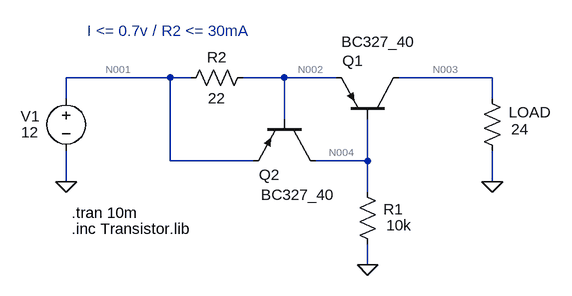
[diagram p0: schematic v1.1.asc]
v1.1.asc, the LTspice schematic file:
Version 4.1
SHEET 1 880 680
WIRE 64 128 -96 128
WIRE 96 128 64 128
WIRE 240 128 176 128
WIRE 320 128 240 128
WIRE 560 128 416 128
WIRE -96 160 -96 128
WIRE 560 160 560 128
WIRE 240 192 240 128
WIRE 64 256 64 128
WIRE 192 256 64 256
WIRE 368 256 368 192
WIRE 368 256 288 256
WIRE -96 288 -96 240
WIRE 560 288 560 240
WIRE 368 304 368 256
WIRE 368 416 368 384
FLAG -96 288 0
FLAG 560 288 0
FLAG 368 416 0
SYMBOL voltage -96 144 R0
WINDOW 0 -70 43 Left 2
WINDOW 3 -69 68 Left 2
WINDOW 123 0 0 Left 0
WINDOW 39 0 0 Left 0
SYMATTR InstName V1
SYMATTR Value 12
SYMBOL res 384 400 R180
WINDOW 0 -39 70 Left 2
WINDOW 3 -52 45 Left 2
SYMATTR InstName R1
SYMATTR Value 10k
SYMBOL res 192 112 R90
WINDOW 0 0 56 VBottom 2
WINDOW 3 32 56 VTop 2
SYMATTR InstName R2
SYMATTR Value 22
SYMBOL res 576 256 R180
WINDOW 0 -75 75 Left 2
WINDOW 3 -40 49 Left 2
SYMATTR InstName LOAD
SYMATTR Value 24
SYMBOL pnp 416 192 M270
WINDOW 0 90 87 VLeft 2
WINDOW 3 119 88 VLeft 2
SYMATTR InstName Q1
SYMATTR Value BC327_40
SYMBOL pnp 288 192 R90
WINDOW 0 85 55 VRight 2
WINDOW 3 116 -30 VRight 2
SYMATTR InstName Q2
SYMATTR Value BC327_40
TEXT -88 336 Left 2 !.tran 10m
TEXT -64 56 Left 2 ;I <= 0.7v / R2 <= 30mA
TEXT -88 360 Left 2 !.inc Transistor.lib

The netlist it stands for:
* v1.1.asc
V1 N001 0 12
R1 0 N004 10k
R2 N002 N001 22
R§LOAD 0 N003 24
Q1 N003 N004 N002 0 BC327_40
Q2 N004 N002 N001 0 BC327_40
.model NPN NPN
.model PNP PNP
.lib standard.bjt
.tran 10m
* I <= 0.7v / R2 <= 30mA
.inc Transistor.lib
.backanno
.end

* Results of the author's LTspice run, read from the files saved beside the schematic
* Operating Point, zero values left out:
*   V(n001) = 12 V
*   V(n002) = 11.42 V
*   V(n003) = 633 mV
*   V(n004) = 10.75 V
*   I(LOAD) = -26.38 mA
*   I(R1) = -1.075 mA
*   I(R2) = -26.43 mA
*   I(V1) = -27.45 mA
*   Ib(Q1) = -52.98 µA
*   Ib(Q2) = -2.815 µA
*   Ic(Q1) = -26.38 mA
*   Ic(Q2) = -1.022 mA
*   Ie(Q1) = 26.43 mA
*   Ie(Q2) = 1.025 mA